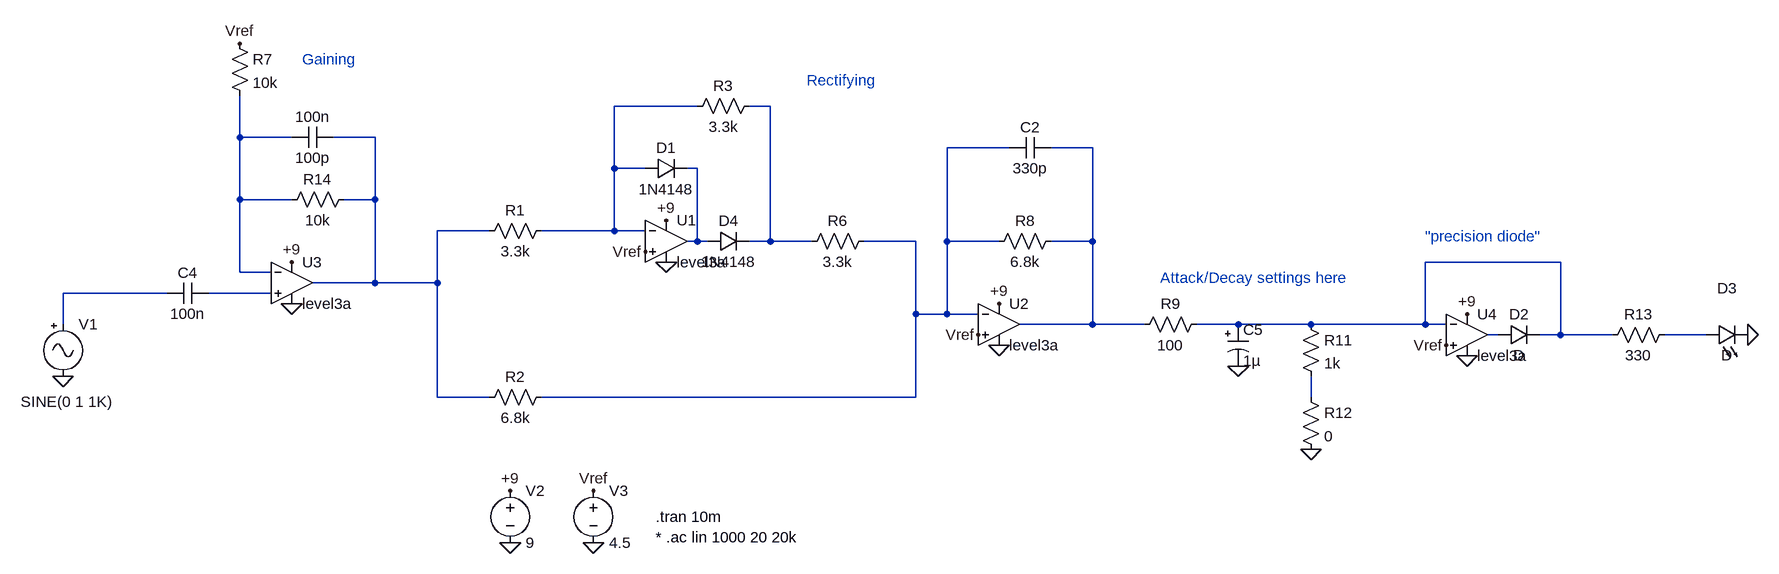
[diagram p0: schematic Sidechain.asc]
Sidechain.asc, the LTspice schematic file:
Version 4
SHEET 1 2556 768
WIRE 608 -48 480 -48
WIRE 720 -48 688 -48
WIRE -96 0 -96 -64
WIRE -16 0 -96 0
WIRE 112 0 48 0
WIRE 1088 16 992 16
WIRE 1216 16 1152 16
WIRE 480 48 480 -48
WIRE 528 48 480 48
WIRE 608 48 592 48
WIRE -96 96 -96 0
WIRE -16 96 -96 96
WIRE 112 96 112 0
WIRE 112 96 64 96
WIRE 288 144 208 144
WIRE 480 144 480 48
WIRE 480 144 368 144
WIRE 528 144 480 144
WIRE 608 160 608 48
WIRE 608 160 592 160
WIRE 624 160 608 160
WIRE 720 160 720 -48
WIRE 720 160 688 160
WIRE 784 160 720 160
WIRE 944 160 864 160
WIRE 992 160 992 16
WIRE 1072 160 992 160
WIRE 1216 160 1216 16
WIRE 1216 160 1152 160
WIRE 1936 192 1728 192
WIRE -96 208 -96 96
WIRE -48 208 -96 208
WIRE 112 224 112 96
WIRE 112 224 16 224
WIRE 208 224 208 144
WIRE 208 224 112 224
WIRE -208 240 -368 240
WIRE -48 240 -144 240
WIRE 944 272 944 160
WIRE 992 272 992 160
WIRE 992 272 944 272
WIRE 1040 272 992 272
WIRE -368 288 -368 240
WIRE 1216 288 1216 160
WIRE 1216 288 1104 288
WIRE 1296 288 1216 288
WIRE 1440 288 1376 288
WIRE 1552 288 1440 288
WIRE 1728 288 1728 192
WIRE 1728 288 1552 288
WIRE 1760 288 1728 288
WIRE 1840 304 1824 304
WIRE 1936 304 1936 192
WIRE 1936 304 1904 304
WIRE 2016 304 1936 304
WIRE 2160 304 2096 304
WIRE 208 400 208 224
WIRE 288 400 208 400
WIRE 944 400 944 272
WIRE 944 400 368 400
WIRE 1552 400 1552 368
FLAG -368 368 0
FLAG 320 624 0
FLAG 448 624 0
FLAG 448 544 Vref
FLAG 320 544 +9
FLAG 560 192 0
FLAG 560 128 +9
FLAG 1040 304 Vref
FLAG 1072 256 +9
FLAG 1072 320 0
FLAG 528 176 Vref
FLAG -16 192 +9
FLAG -16 256 0
FLAG 1440 352 0
FLAG 1552 480 0
FLAG 1792 272 +9
FLAG 1760 320 Vref
FLAG 1792 336 0
FLAG 2224 304 0
FLAG -96 -144 Vref
SYMBOL Misc/signal -368 272 R0
WINDOW 3 -65 135 Left 2
SYMATTR InstName V1
SYMBOL OpAmps/UniversalOpAmp3 560 160 R0
SYMATTR InstName U1
SYMBOL Res 384 128 R90
WINDOW 0 0 56 VBottom 2
WINDOW 3 32 56 VTop 2
SYMATTR InstName R1
SYMATTR Value 3.3k
SYMBOL Res 384 384 R90
WINDOW 0 0 56 VBottom 2
WINDOW 3 32 56 VTop 2
SYMATTR InstName R2
SYMATTR Value 6.8k
SYMBOL voltage 320 528 R0
SYMATTR InstName V2
SYMATTR Value 9
SYMBOL voltage 448 528 R0
SYMATTR InstName V3
SYMATTR Value 4.5
SYMBOL diode 528 64 R270
WINDOW 0 32 32 VTop 2
WINDOW 3 0 32 VBottom 2
SYMATTR InstName D1
SYMATTR Value 1N4148
SYMBOL Res 704 -64 R90
WINDOW 0 0 56 VBottom 2
WINDOW 3 32 56 VTop 2
SYMATTR InstName R3
SYMATTR Value 3.3k
SYMBOL diode 624 176 R270
WINDOW 0 32 32 VTop 2
WINDOW 3 0 32 VBottom 2
SYMATTR InstName D4
SYMATTR Value 1N4148
SYMBOL Res 880 144 R90
WINDOW 0 0 56 VBottom 2
WINDOW 3 32 56 VTop 2
SYMATTR InstName R6
SYMATTR Value 3.3k
SYMBOL OpAmps/UniversalOpAmp3 1072 288 R0
SYMATTR InstName U2
SYMBOL Res 1168 144 R90
WINDOW 0 0 56 VBottom 2
WINDOW 3 32 56 VTop 2
SYMATTR InstName R8
SYMATTR Value 6.8k
SYMBOL OpAmps/UniversalOpAmp3 -16 224 R0
SYMATTR InstName U3
SYMBOL Cap -144 224 R90
WINDOW 0 0 32 VBottom 2
WINDOW 3 32 32 VTop 2
SYMATTR InstName C4
SYMATTR Value 100n
SYMBOL Cap 1152 0 R90
WINDOW 0 0 32 VBottom 2
WINDOW 3 32 32 VTop 2
SYMATTR InstName C2
SYMATTR Value 330p
SYMBOL Res 1392 272 R90
WINDOW 0 0 56 VBottom 2
WINDOW 3 32 56 VTop 2
SYMATTR InstName R9
SYMATTR Value 100
SYMBOL polcap 1424 288 R0
SYMATTR InstName C5
SYMATTR Value 1µ
SYMBOL Res 1536 272 R0
SYMATTR InstName R11
SYMATTR Value 1k
SYMBOL Res 1536 384 R0
SYMATTR InstName R12
SYMATTR Value 0
SYMBOL OpAmps/UniversalOpAmp3 1792 304 R0
SYMATTR InstName U4
SYMBOL Diode 1840 320 R270
WINDOW 0 32 32 VTop 2
WINDOW 3 0 32 VBottom 2
SYMATTR InstName D2
SYMBOL Res 2112 288 R90
WINDOW 0 0 56 VBottom 2
WINDOW 3 32 56 VTop 2
SYMATTR InstName R13
SYMATTR Value 330
SYMBOL LED 2160 320 R270
WINDOW 0 72 32 VTop 2
WINDOW 3 0 32 VBottom 2
SYMATTR InstName D3
SYMBOL Res -112 -160 R0
SYMATTR InstName R7
SYMATTR Value 10k
SYMBOL Res 80 80 R90
WINDOW 0 0 56 VBottom 2
WINDOW 3 32 56 VTop 2
SYMATTR InstName R14
SYMATTR Value 10k
SYMBOL Cap 48 -16 R90
WINDOW 0 0 32 VBottom 2
WINDOW 3 32 32 VTop 2
SYMATTR InstName 100n
SYMATTR Value 100p
TEXT 544 584 Left 2 !.tran 10m\n* .ac lin 1000 20 20k
TEXT 1320 216 Left 2 ;Attack/Decay settings here
TEXT 0 -120 Left 2 ;Gaining
TEXT 776 -88 Left 2 ;Rectifying
TEXT 1728 152 Left 2 ;"precision diode"

The netlist it stands for:
* Sidechain.asc
V1 N009 0 SINE(0 1 1K)
XU1 Vref N001 +9 0 N007 level3a  ; pins In+ In- V+ V- OUT
R1 N001 N004 3.3k
R2 N005 N004 6.8k
V2 +9 0 9
V3 Vref 0 4.5
D1 N001 N007 1N4148
R3 N002 N001 3.3k
D4 N007 N002 1N4148
R6 N005 N002 3.3k
XU2 Vref N005 +9 0 N006 level3a  ; pins In+ In- V+ V- OUT
R8 N006 N005 6.8k
XU3 N010 N003 +9 0 N004 level3a  ; pins In+ In- V+ V- OUT
C4 N010 N009 100n
C2 N006 N005 330p
R9 N008 N006 100
C5 N008 0 1µ
R11 N008 N013 1k
R12 N013 0 0
XU4 Vref N008 +9 0 N011 level3a  ; pins In+ In- V+ V- OUT
D2 N011 N008 D
R13 N012 N008 330
D3 N012 0 D
R7 Vref N003 10k
R14 N004 N003 10k
C§100n N004 N003 100p
.model D D
.lib standard.dio
.tran 10m
* .ac lin 1000 20 20k
* Attack/Decay settings here
* Gaining
* Rectifying
* "precision diode"
.backanno
.end